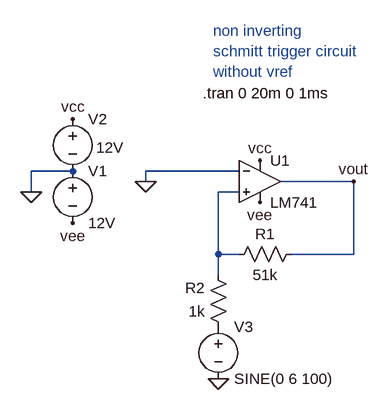
[diagram p0: schematic non_inverting_schmitt_trigger_without_vref.asc]
non_inverting_schmitt_trigger_without_vref.asc, the LTspice schematic file:
Version 4.1
SHEET 1 880 680
WIRE -32 176 -96 176
WIRE 224 176 80 176
WIRE 80 192 80 176
WIRE 400 192 288 192
WIRE -96 208 -96 176
WIRE 224 208 192 208
WIRE 192 304 192 208
WIRE 224 304 192 304
WIRE 400 304 400 192
WIRE 400 304 304 304
WIRE 192 336 192 304
FLAG -96 208 0
FLAG -32 96 vcc
FLAG -32 256 vee
FLAG 192 496 0
FLAG 256 160 vcc
FLAG 256 224 vee
FLAG 400 192 vout
FLAG 80 192 0
SYMBOL voltage -32 160 R0
WINDOW 123 0 0 Left 0
WINDOW 39 0 0 Left 0
SYMATTR InstName V1
SYMATTR Value 12V
SYMBOL voltage -32 80 R0
WINDOW 3 36 60 Left 2
WINDOW 123 0 0 Left 0
WINDOW 39 0 0 Left 0
SYMATTR InstName V2
SYMATTR Value 12V
SYMBOL LM741 256 128 R0
SYMATTR InstName U1
SYMBOL res 320 288 R90
WINDOW 0 0 56 VBottom 2
WINDOW 3 32 56 VTop 2
SYMATTR InstName R1
SYMATTR Value 51k
SYMBOL res 208 432 R180
WINDOW 0 36 76 Left 2
WINDOW 3 36 40 Left 2
SYMATTR InstName R2
SYMATTR Value 1k
SYMBOL voltage 192 400 R0
WINDOW 123 0 0 Left 0
WINDOW 39 0 0 Left 0
SYMATTR InstName V3
SYMATTR Value SINE(0 6 100)
TEXT 184 -40 Left 2 ;non inverting \nschmitt trigger circuit\nwithout vref
TEXT 168 56 Left 2 !.tran 0 20m 0 1ms

The netlist it stands for:
* non_inverting_schmitt_trigger_without_vref.asc
V1 0 vee 12V
V2 vcc 0 12V
X§U1 N001 0 vcc vee vout LM741  ; pins In+ In- V+ V- OUT
R1 vout N001 51k
R2 P001 N001 1k
V3 P001 0 SINE(0 6 100)
* non inverting
* schmitt trigger circuit
* without vref
.tran 0 20m 0 1ms
.lib LM741.lib
.backanno
.end